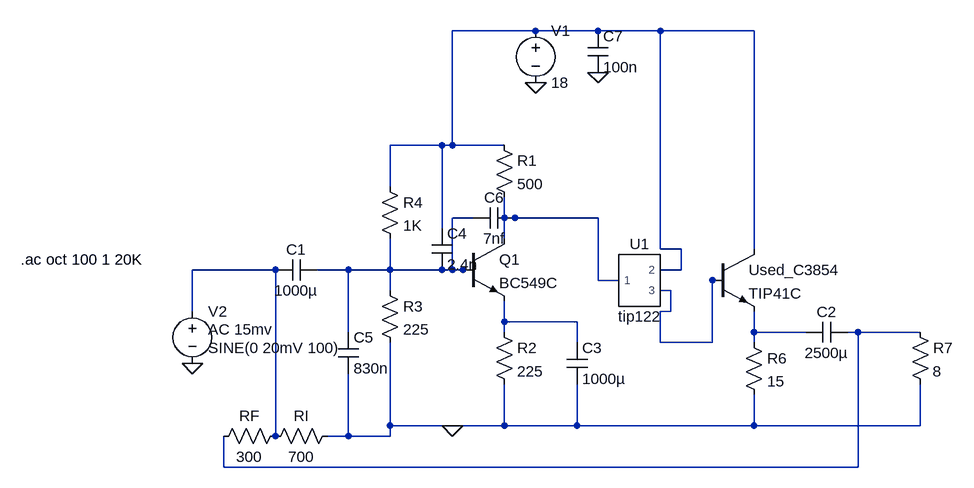
[diagram p0: schematic Awesome - CE BC549 and Tip122 with FB with low resitor values-sounds good.asc]
Awesome - CE BC549 and Tip122 with FB with low resitor values-sounds good.asc, the LTspice schematic file:
Version 4
SHEET 1 920 680
WIRE 272 -256 144 -256
WIRE 368 -256 272 -256
WIRE 464 -256 368 -256
WIRE 608 -256 464 -256
WIRE 128 -80 48 -80
WIRE 144 -80 144 -256
WIRE 144 -80 128 -80
WIRE 224 -80 144 -80
WIRE 48 -16 48 -80
WIRE 176 32 144 32
WIRE 224 32 224 0
WIRE 240 32 224 32
WIRE 368 32 240 32
WIRE 128 48 128 -80
WIRE 224 64 224 32
WIRE 464 80 464 -256
WIRE 496 80 464 80
WIRE 608 80 608 -256
WIRE -128 112 -256 112
WIRE -16 112 -64 112
WIRE 48 112 48 64
WIRE 48 112 -16 112
WIRE 128 112 48 112
WIRE 144 112 144 32
WIRE 144 112 128 112
WIRE 160 112 144 112
WIRE 176 112 160 112
WIRE 496 112 496 80
WIRE 496 112 464 112
WIRE 368 128 368 32
WIRE 400 128 368 128
WIRE 560 128 544 128
WIRE 48 144 48 112
WIRE 480 144 464 144
WIRE -256 176 -256 112
WIRE 480 176 480 144
WIRE 480 176 464 176
WIRE 224 192 224 160
WIRE 336 192 224 192
WIRE -16 208 -16 112
WIRE 224 208 224 192
WIRE 608 208 608 176
WIRE 688 208 608 208
WIRE 768 208 752 208
WIRE 864 208 768 208
WIRE 336 224 336 192
WIRE 464 224 464 176
WIRE 544 224 544 128
WIRE 544 224 464 224
WIRE 608 224 608 208
WIRE 48 352 48 224
WIRE 144 352 48 352
WIRE 224 352 224 288
WIRE 224 352 144 352
WIRE 336 352 336 288
WIRE 336 352 224 352
WIRE 608 352 608 304
WIRE 608 352 336 352
WIRE 864 352 864 288
WIRE 864 352 608 352
WIRE -128 368 -128 112
WIRE -16 368 -16 272
WIRE -16 368 -48 368
WIRE 48 368 48 352
WIRE 48 368 -16 368
WIRE -208 416 -208 368
WIRE 768 416 768 208
WIRE 768 416 -208 416
FLAG 272 -176 0
FLAG 144 352 0
FLAG -256 256 0
FLAG 368 -192 0
SYMBOL npn 160 64 R0
SYMATTR InstName Q1
SYMATTR Value BC549C
SYMBOL res 208 -96 R0
SYMATTR InstName R1
SYMATTR Value 500
SYMBOL voltage 272 -272 R0
WINDOW 123 0 0 Left 2
WINDOW 39 0 0 Left 2
SYMATTR InstName V1
SYMATTR Value 18
SYMBOL res 32 -32 R0
SYMATTR InstName R4
SYMATTR Value 1K
SYMBOL res 32 128 R0
SYMATTR InstName R3
SYMATTR Value 225
SYMBOL res 208 192 R0
SYMATTR InstName R2
SYMATTR Value 225
SYMBOL cap 320 224 R0
SYMATTR InstName C3
SYMATTR Value 1000µ
SYMBOL cap -64 96 R90
WINDOW 0 0 32 VBottom 2
WINDOW 3 32 32 VTop 2
SYMATTR InstName C1
SYMATTR Value 1000µ
SYMBOL voltage -256 160 R0
WINDOW 123 24 44 Left 2
WINDOW 39 0 0 Left 2
WINDOW 3 24 72 Left 2
SYMATTR Value2 AC 15mv
SYMATTR Value SINE(0 20mV 100)
SYMATTR InstName V2
SYMBOL npn 544 80 R0
SYMATTR InstName Used_C3854
SYMATTR Value TIP41C
SYMBOL res 592 208 R0
SYMATTR InstName R6
SYMATTR Value 15
SYMBOL res 848 192 R0
WINDOW 3 35 76 Left 2
SYMATTR Value 8
SYMATTR InstName R7
SYMBOL cap 752 192 R90
WINDOW 0 0 32 VBottom 2
WINDOW 3 32 32 VTop 2
SYMATTR InstName C2
SYMATTR Value 2500µ
SYMBOL res -112 352 R90
WINDOW 0 0 56 VBottom 2
WINDOW 3 32 56 VTop 2
SYMATTR InstName RF
SYMATTR Value 300
SYMBOL res -32 352 R90
WINDOW 0 0 56 VBottom 2
WINDOW 3 32 56 VTop 2
SYMATTR InstName RI
SYMATTR Value 700
SYMBOL cap 112 48 R0
SYMATTR InstName C4
SYMATTR Value 2.4n
SYMBOL cap -32 208 R0
SYMATTR InstName C5
SYMATTR Value 830n
SYMBOL cap 240 16 R90
WINDOW 0 0 32 VBottom 2
WINDOW 3 32 32 VTop 2
SYMATTR InstName C6
SYMATTR Value 7nf
SYMBOL cap 352 -256 R0
SYMATTR InstName C7
SYMATTR Value 100n
SYMBOL AutoGenerated\\tip122 432 128 R0
SYMATTR InstName U1
TEXT -520 96 Left 2 !.ac oct 100 1 20K

The netlist it stands for:
* Awesome - CE BC549 and Tip122 with FB with low resitor values-sounds good.asc
Q1 N003 N002 N006 0 BC549C
R1 N001 N003 500
V1 N001 0 18
R4 N001 N002 1K
R3 N002 0 225
R2 N006 0 225
C3 N006 0 1000µ
C1 N002 N004 1000µ
V2 N004 0 SINE(0 20mV 100) AC 15mv
Q§Used_C3854 N001 N005 N007 0 TIP41C
R6 N007 0 15
R7 N008 0 8
C2 N008 N007 2500µ
RF N004 N008 300
RI 0 N004 700
C4 N001 N002 2.4n
C5 N002 0 830n
C6 N003 N002 7nf
C7 N001 0 100n
XU1 N003 N001 N005 tip122  ; pins 1 2 3
.model NPN NPN
.model PNP PNP
.lib standard.bjt
.ac oct 100 1 20K
.lib F:\electronics\LTspiceIV\mycircuits\TIP122.SP3
.backanno
.end